# Altium schematic sheet LoRa.SchDoc
size 420 x 297 mm; Date: TEST; SheetNumber: 1; SheetTotal: 1
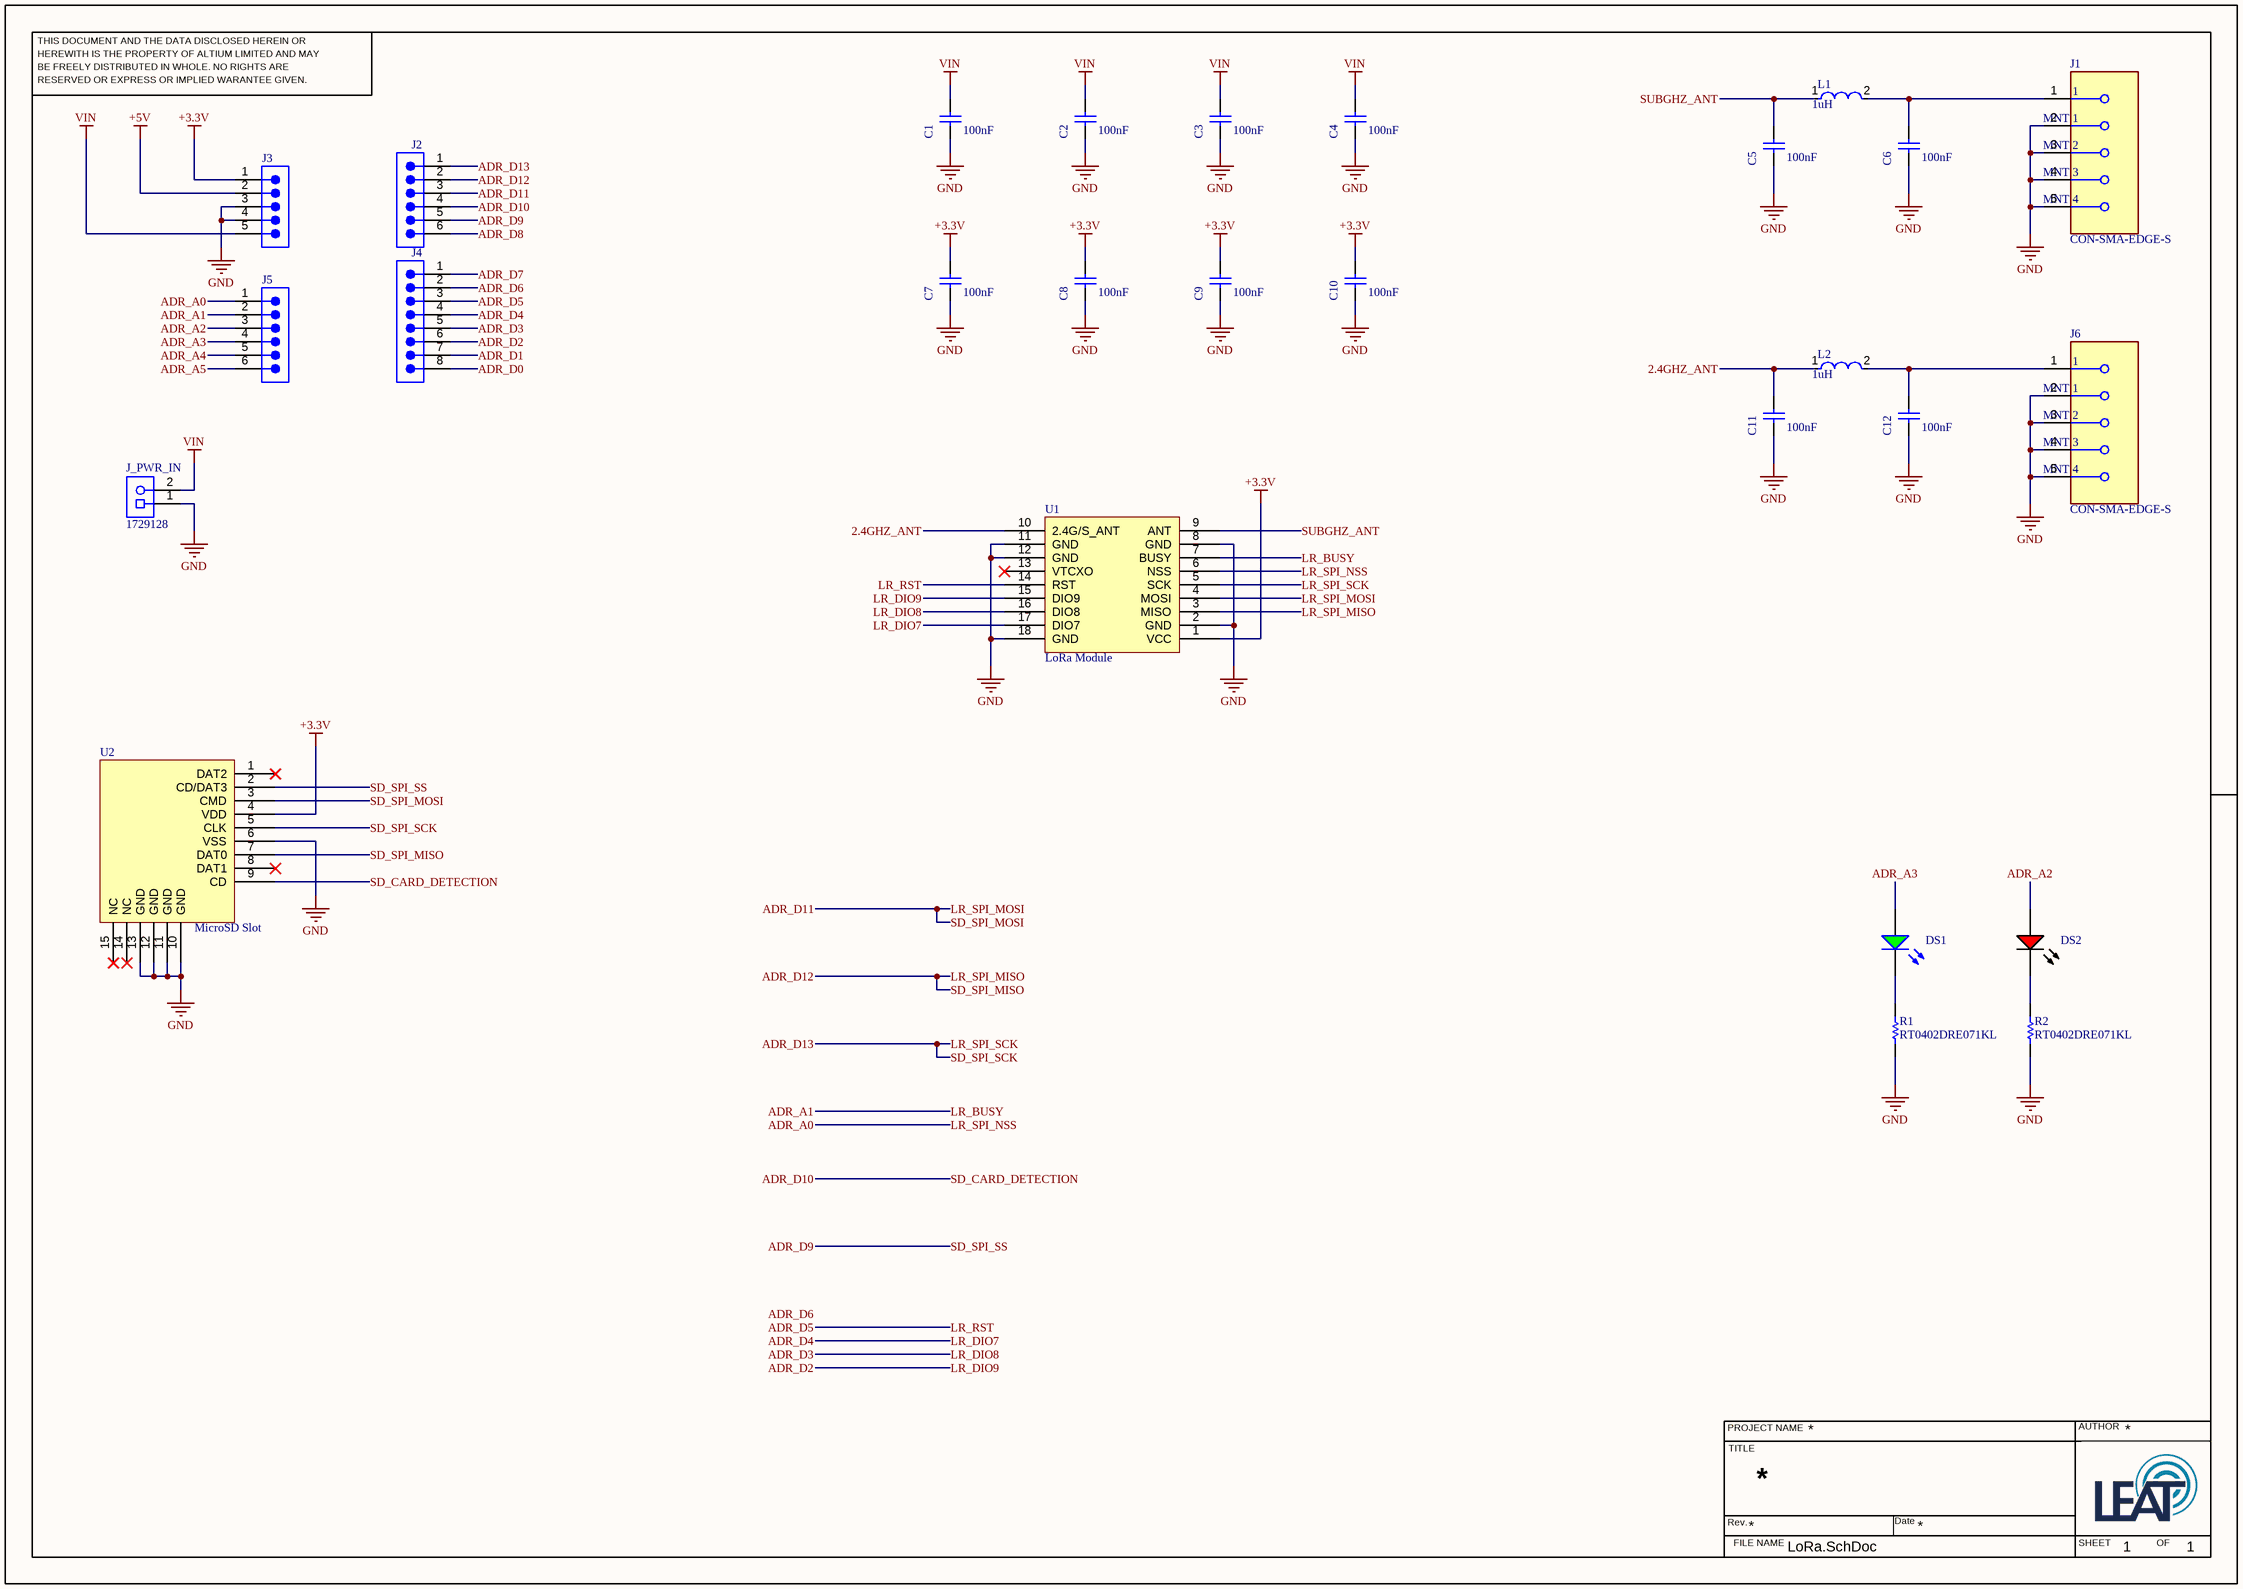
[diagram p0: LoRa.SchDoc]

## Parts
C1  Capacitance: 100nF  [WCAP-CSGP_0402_L1W0.5H0.5]  (hidden comment: 885012205037)
C2  Capacitance: 100nF  [WCAP-CSGP_0402_L1W0.5H0.5]  (hidden comment: 885012205037)
C3  Capacitance: 100nF  [WCAP-CSGP_0402_L1W0.5H0.5]  (hidden comment: 885012205037)
C4  Capacitance: 100nF  [WCAP-CSGP_0402_L1W0.5H0.5]  (hidden comment: 885012205037)
C5  Capacitance: 100nF  [WCAP-CSGP_0402_L1W0.5H0.5]  (hidden comment: 885012205037)
C6  Capacitance: 100nF  [WCAP-CSGP_0402_L1W0.5H0.5]  (hidden comment: 885012205037)
C7  Capacitance: 100nF  [WCAP-CSGP_0402_L1W0.5H0.5]  (hidden comment: 885012205037)
C8  Capacitance: 100nF  [WCAP-CSGP_0402_L1W0.5H0.5]  (hidden comment: 885012205037)
C9  Capacitance: 100nF  [WCAP-CSGP_0402_L1W0.5H0.5]  (hidden comment: 885012205037)
C10  Capacitance: 100nF  [WCAP-CSGP_0402_L1W0.5H0.5]  (hidden comment: 885012205037)
C11  Capacitance: 100nF  [WCAP-CSGP_0402_L1W0.5H0.5]  (hidden comment: 885012205037)
C12  Capacitance: 100nF  [WCAP-CSGP_0402_L1W0.5H0.5]  (hidden comment: 885012205037)
DS1  LTST-S220GKT  [LTST-S220GKT_V]  (value not drawn)
DS2  LTST-C170KRKT  [LTST-C170KRKT_V]  (value not drawn)
J1  CON-SMA-EDGE-S  [FP-CON-SMA-EDGE-S-MFG]
J2  61300611121  [61300611121]  (value not drawn)
J3  61300511121  [61300511121]  (value not drawn)
J4  61300811121  [61300811121]  (value not drawn)
J5  61300611121  [61300611121]  (value not drawn)
J6  CON-SMA-EDGE-S  [FP-CON-SMA-EDGE-S-MFG]
J_PWR_IN  1729128  [PHOE-1729128-2_V]
L1  Inductance: 1uH  [FP-MLZ1005-MFG]  (hidden comment: MLZ1005M1R0WT000)
L2  Inductance: 1uH  [FP-MLZ1005-MFG]  (hidden comment: MLZ1005M1R0WT000)
R1  RT0402DRE071KL  [RESC1005X35X25ML10T10]
R2  RT0402DRE071KL  [RESC1005X35X25ML10T10]
U1  LoRa Module  [LR2021]
U2  MicroSD Slot  [TF-01A]

## Nets
+3.3V: C7.2 C8.2 C9.2 C10.2 J3.1 U1.1(VCC) U2.4(VDD)
+5V: J3.2
GND: C1.1 C2.1 C3.1 C4.1 C5.1 C6.1 C7.1 C8.1 C9.1 C10.1 C11.1 C12.1 J1.2(MNT_1) J1.3(MNT_2) J1.4(MNT_3) J1.5(MNT_4) J3.3 J3.4 J6.2(MNT_1) J6.3(MNT_2) J6.4(MNT_3) J6.5(MNT_4) J_PWR_IN.1 R1.1 R2.1 U1.2(GND) U1.8(GND) U1.11(GND) U1.12(GND) U1.18(GND) U2.6(VSS) U2.10(GND) U2.11(GND) U2.12(GND) U2.13(GND)
VIN: C1.2 C2.2 C3.2 C4.2 J3.5 J_PWR_IN.2
2.4GHZ_ANT: C11.2 L2.1 U1.10(2.4G/S_ANT)
ADR_A0: J5.1 U1.6(NSS)  [also labelled LR_SPI_NSS]
ADR_A1: J5.2 U1.7(BUSY)  [also labelled LR_BUSY]
ADR_A2: DS2.1(A) J5.3
ADR_A3: DS1.1(A) J5.4
ADR_A4: J5.5
ADR_A5: J5.6
ADR_D0: J4.8
ADR_D1: J4.7
ADR_D2: J4.6 U1.15(DIO9)  [also labelled LR_DIO9]
ADR_D3: J4.5 U1.16(DIO8)  [also labelled LR_DIO8]
ADR_D4: J4.4 U1.17(DIO7)  [also labelled LR_DIO7]
ADR_D5: J4.3 U1.14(RST)  [also labelled LR_RST]
ADR_D6: J4.2
ADR_D7: J4.1
ADR_D8: J2.6
ADR_D9: J2.5 U2.2(CD/DAT3)  [also labelled SD_SPI_SS]
ADR_D10: J2.4 U2.9(CD)  [also labelled SD_CARD_DETECTION]
ADR_D11: J2.3 U1.4(MOSI) U2.3(CMD)  [also labelled LR_SPI_MOSI, SD_SPI_MOSI]
ADR_D12: J2.2 U1.3(MISO) U2.7(DAT0)  [also labelled LR_SPI_MISO, SD_SPI_MISO]
ADR_D13: J2.1 U1.5(SCK) U2.5(CLK)  [also labelled LR_SPI_SCK, SD_SPI_SCK]
SUBGHZ_ANT: C5.2 L1.1 U1.9(ANT)
NetC6_2: C6.2 J1.1 L1.2
NetC12_2: C12.2 J6.1 L2.2
NetDS1_2: DS1.2(K) R1.2
NetDS2_2: DS2.2(K) R2.2

Not connected (* = marked no-connect by the designer): U1 13(VTCXO)*; U2 1(DAT2)* 8(DAT1)* 14(NC)* 15(NC)*

## Notes on the sheet
- Labels drawn without touching a wire or pin: ADR_D6
- THIS DOCUMENT AND THE DATA DISCLOSED HEREIN OR
- HEREWITH IS THE PROPERTY OF ALTIUM LIMITED AND MAY
- BE FREELY DISTRIBUTED IN WHOLE. NO RIGHTS ARE
- RESERVED OR EXPRESS OR IMPLIED WARANTEE GIVEN.
- PROJECT NAME
- TITLE
- AUTHOR
- Rev.
- FILE NAME
- Date
- SHEET
- OF

## Library data of the parts
C1-C12 = CMP-207839-000001-3: Cap Ceramic 0.1uF 16V X7R 10% Pad SMD 0402 125C T/R; Insulation Resistance: 5GΩ; Case Code (Imperial): 0402; Case/Package: 0402; REACH SVHC: Unknown; Mount: Surface Mount; Thickness: 558.8µm; Dielectric: X7R; Min Operating Temperature: -55°C; Length: 1mm; Max Operating Temperature: 125°C; Material: Ceramic; Voltage Rating (DC): 16V; RoHS: Compliant; Voltage Rating: 16V; Height: 500µm; Width: 500µm; Case Code (Metric): 1005; Tolerance: 10%
DS1 = CMP-2000-06627-1: LED Green, 100 mW, 30 mA, -55 to 85 degC, 2-Pin SMD, RoHS, Tape and Reel; Manufacturer: Lite-On; Product Height (mm): 1mm; Number of  Elements: 1; Viewing Angle: 130deg; Test Current (It): 20mA; Reverse Voltage: 5V; Emitting Color: YellowGreen; High Brightness: No; Type: Uni-Color; Forward Current: 30mA; Peak Wavelength: 565nm; Shape Type: Rectangular; Main Category: ChipLED; Luminous Intensity: 20mcd; Power Dissipation: 100W; DELETED: Compliant; Product Depth (mm): 0.6mm; Forward Voltage: 2.6V; Dominant Wave Length: 569nm; Product Length (mm): 2.1mm; Package Reference: S220GKT; Operating Temperature Classification: Industrial; Operating Temp Range: -55Cto85C; Package Type: SMD; Pin Count: 2; Mounting: SurfaceMount; Mounting Technology: SurfaceMount; Datasheet URL: http://media.digikey.com/pdf/Data%20Sheets/Lite-On%20PDFs/LTST-S220GKT.pdf; Datasheet Version: 03/2000; Lum Intensity: 20mcd; Rad Hardened: No; Manufacturer URL: http://www.us.liteon.com/; Package Description: 2-Pin Surface Mount Device, Body 2.1 x 0.6 mm; Packaging: TapeandReel; Lens Dimensions: 1.7x0.6x0.5mm
DS2 = CMP-2000-07593-1: LED Red, 75 mW, 54 mcd, -55 to 85 degC, 2-Pin SMD, RoHS, Tape and Reel; Manufacturer: Lite-On; Lens Transparency: Clear; Number of Elements: 1; Power Rating: 75mW; Luminous Intensity: 54mcd; Viewing Angle: 130degrees; Forward Current: 30mA; Wavelength: 639nm; Lens Style: Rectangular; Case\/Package: 0805; Test Current: 20mA; Dominant Wavelength: 631nm; Forward Voltage: 2V; Lens Colour: Colorless; Min Operating Temperature: -55degC; RoHSCompliant: True; Length: 3.2mm; Width: 1.25mm; Mount: SurfaceMount; Packaging: TapeandReel; Number of LEDs: 1; Radiation Hardening: No; Datasheet URL: http://optoelectronics.liteon.com/upload/download/DS-22-99-0150/LTST-C170KRKT.pdf; Datasheet Version: Rev. D, 11/2014; Case Code (Metric): 2012; Height: 1.1mm; Number of Pins: 2; Package Description: 2-Pin Surface Mount Device, Body 2 x 1.25 mm; Manufacturer URL: http://www.us.liteon.com/; Lead Free: LeadFree; Illumination Colour: Red; Colour: Red; Case Code (Imperial): 0805; Max Operating Temperature: 85degC; Power Dissipation: 75mW; Mounting Technology: SurfaceMount; Package Reference: C170KRKT; Package Quantity: 1; Depth: 1.6mm
J1 J6 = CMP-204357-000001-1: CONN SMA JACK STR EDGE MNT; Manufacturer: RF Solutions Ltd.; Impedance: 50Ω; Conn Orientation: Right Angle; Is Female: yes; Number Of Contacts: 1; Frequency: 18GHz; Shielding: true; Category: Conn; ComponentLink2URL: https://www.rfsolutions.co.uk/downloads/1498648656DS-CON-EDGE-SMA-4.pdf; Octopart: https://octopart.com/con-sma-edge-s-rf+solutions-70967450; Package: CONN_JACK; Manufacturer Part Number: CON-SMA-EDGE-S; Height: 6.35mm; Device Class L1: Connectors; Footprint Url: https://forum.upverter.com/uploads/default/original/3X/b/e/be75b907af57498775929d6d9099689c472e0307.pdf; Contact Material: Gold; ComponentLink2Description: Datasheet; Device Class L2: RF / Coaxial Connectors; RoHS: TRUE; Device Class L3: unset; Digikey Description: CONN SMA JACK STR EDGE MNT; Lead Free: Yes; Automotive: No
J2 J5 = CMP-1502-01070-4: THT Vertical Pin Header WR-PHD, Pitch 2.54 mm, Single Row, 6 pins; Pitch: 2.54mm; Operating Supply Voltage: 250V; Connector Type: Male Pin; Gender: Male; Number of Positions: 6; Contact Resistance: 20mΩ; Current Rating: 3A; Termination: Through Hole; Color: Black; Number of Pins: 6; Lead Pitch: 2.54mm; Height: 8.89mm; RoHS: Compliant; Lead Free: Lead Free; Contact Mating Length: 5.9944mm; Contact Plating: Gold; Contact Gender: Male; Packaging: Bulk; Orientation: Vertical; Mount: Through Hole; Voltage Rating: 250V; Number of Rows: 1; Max Operating Temperature: 105°C; Min Operating Temperature: -40°C; Housing Material: PBT; Contact Material: Gold; Number of Contacts: 6
J3 = CMP-1502-01068-4: THT Vertical Pin Header WR-PHD, Pitch 2.54 mm, Single Row, 5 pins; Number of Contacts: 5; Connector Type: Male Pin; Operating Supply Voltage: 250V; Contact Resistance: 20mΩ; Gender: Male; Pitch: 2.54mm; Current Rating: 3A; Min Operating Temperature: -40°C; Contact Material: Gold; Color: Black; RoHS: Compliant; Number of Rows: 1; Lead Free: Lead Free; Height: 8.89mm; Contact Plating: Gold; Number of Pins: 5; Orientation: Vertical; Voltage Rating: 250V; Packaging: Bulk; Number of Positions: 5; Max Operating Temperature: 105°C; Termination: Solder; Lead Pitch: 2.54mm; Contact Mating Length: 5.9944mm; Mount: Through Hole
J4 = CMP-1502-01076-4: THT Vertical Pin Header WR-PHD, Pitch 2.54 mm, Single Row, 8 pins; Pitch: 2.54mm; Voltage Rating: 250V; Connector Type: Male Pin; Current Rating: 3A; Contact Resistance: 20mΩ; Number of Positions: 8; Gender: Male; Contact Mating Length: 5.9944mm; Orientation: Vertical; Contact Plating: Gold; Mount: Through Hole; Min Operating Temperature: -40°C; Packaging: Bulk; Height: 8.54mm; Number of Pins: 8; Contact Material: Gold; Operating Supply Voltage: 250V; Termination: Solder; RoHS: Compliant; Color: Black; Number of Contacts: 8; Lead Pitch: 2.54mm; Number of Rows: 1; Max Operating Temperature: 105°C
J_PWR_IN = CMP-2000-05815-1: PCB Terminal Block, 13.5 A, 400 V, 2-Pin THD, RoHS, Bulk; Manufacturer: Phoenix Contact; Package Version: 03/2015; No. of Rows: 1; Pitch: 5.08mm; No. of Positions: 2; Voltage Rating: 400V; Current Rating: 13500mA; Manufacturer URL: http://www.phoenixcontact.com/; Datasheet URL: https://datasheet.ciiva.com/16046/1729128-16046181.pdf; RoHS: TRUE; Package URL: https://www.phoenixcontact.com/online/portal/pi/pxc/product_detail_page/!ut/p/b1/3VdJjqNKFDxLH8AFycySyWY2ozFsEPOMMQaDOX1XedGL_1Vdm5YXJleknhSKeBkvI6EA8ncAo3AYoDhBQGco6KN7VURTdemj9us_IEKEZo_YHiPAEWEFmDGOHMORkqKYCORBZxgL7ZoaZYcbFFUZ3fqxSY6GOuxydWUuHqz1ynmMFygu583Bob0Ewr6Sd_l-5m-kAueHiB0jpRwZwe58wwtkpxtMYd_LmGcDRU02dRNEyWt6Y2ti5pSyJ_reIkzIulrqApdnbT11V5jnCKbYNCvhEM1MCpPByat_X379-iThf08CI5GfOPqfBeS3BRoBOdD55AKVv0iLwCMq-2BrzXWSGRH7pUGD9uwXQjiph3xL0DKQwdGa0JImiIOmBNOestqgwTHSSs2oOep-78apyXQBvNi8ZLaFjvjWvcaUEBu0MC6Wbe-d6mB0FAebo2lUWinqYaZs5DAYzV0RP9yitUjnGJ0iI9xhZkT42OCQNUJJhkgWINNQLP2JFP6OpMg3JCVg70jqHT0lvKOnhHf0lPuOnnLf0VPuWx6_dxwUIvwk5WMkT0kLL1mh61l2yZVSzG3pYV_bqo-mj6uMKwKwdnnW8Jh5RTOJzMOA5c-eJDaZQw4mTMPH02PvS_ZAqNVjVTo2WyYLkwH_KU1mmmG5kjRhDqPXLwwVHvVOjCM60-fpXvTDfMGW1PVFVS1r4e4yVDk4ZdNbkUHvqPqQSeian4UD39fNKmachqdJ1NJbyk8rXT9mXTvPk3oE5meulKGgiruPJek-4I9hTT6G8ZLOyRSm2RRVbThERQad5OS28hdt4YW4vG0stgYYzsWsK4_7y6DZMjJSCqri1kyiZR5vD7pwIrNR7QwPHTcLTI5qT7eRlpHrdGiupYlqQDJ7zy_CND8fWWBoLRXxk1RVcXiBQwbTD4Xi7KL-FuO94t9xaqweXzH; PartNumber: 1729128; Package Description: 2-Pin Through Hole Device, Body 8.1 x 10.16 mm, Pitch 5.08 mm; Datasheet Version: 12/2013; Mounting Technology: ThroughHole; Orientation: Horizontal; Package Reference: 1729128-2; Packing: Bulk
L1 L2 = CMP-08253-000219-1: Shielded Multilayer Inductor 1uH ±20% 450mA 455mΩ SMD 0402; Core Material: Ferrite; Saturation Current: 100mA; Self Resonant Frequency: 170MHz; DC Resistance (DCR): 455mR; Test Frequency: 2MHz; Width: 0.02inch; Tolerance: 20%; Package Quantity: 10000; Current Rating: 450mA; Length: 0.039inch; RoHS Compliant: Yes; Max Operating Temperature: 125°C; Height - Seated (Max): 0.022inch; Packaging: Tape and Reel; Case Code (Metric): 1005; Case Code (Imperial): 0402; Min Operating Temperature: -55°C; Case/Package: 0402; Mount: Surface Mount; Shielding: Shielded
R1 R2 = CMP-2002-02598-1: Manufacturer: Yageo; Part Number: RT0402DRE071KL
U1 = LR2021: LoRa2021: 160mW Multi-Band Wireless Communication Module
U2 = TF-01A: 1.85mm Card Slot MicroSD card (TF card) Self-bouncing SMD SD Card / Memory Card Connector ROHS; Parameter 1: *